# Altium schematic sheet Analog Input Noise Canceller.SchDoc
size A
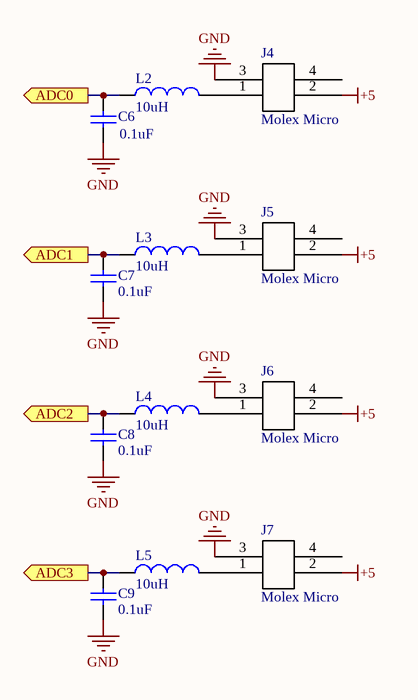
[diagram p0: Analog Input Noise Canceller.SchDoc]

## Parts
C6  0.1uF  [CAPC2013X94X50LL20T25]
C7  0.1uF  [CAPC2013X94X50LL20T25]
C8  0.1uF  [CAPC2013X94X50LL20T25]
C9  0.1uF  [CAPC2013X94X50LL20T25]
J4  Molex Micro  [0430450427]
J5  Molex Micro  [0430450427]
J6  Molex Micro  [0430450427]
J7  Molex Micro  [0430450427]
L2  10uH  [TDK-IND0805-125_V]
L3  10uH  [TDK-IND0805-125_V]
L4  10uH  [TDK-IND0805-125_V]
L5  10uH  [TDK-IND0805-125_V]

## Ports
ADC0 (out), ADC1 (out), ADC2 (out), ADC3 (out)

## Nets
+5: J4.2 J5.2 J6.2 J7.2
GND: C6.2 C7.2 C8.1 C9.1 J4.3 J5.3 J6.3 J7.3
ADC0: C6.1 L2.1 ; port ADC0
ADC1: C7.1 L3.1 ; port ADC1
ADC2: C8.2 L4.1 ; port ADC2
ADC3: C9.2 L5.1 ; port ADC3
NetJ4_1: J4.1 L2.2
NetJ5_1: J5.1 L3.2
NetJ6_1: J6.1 L4.2
NetJ7_1: J7.1 L5.2

Not connected (* = marked no-connect by the designer): J4 4; J5 4; J6 4; J7 4

## Library data of the parts
C6-C9 = CMP-2000-05808-1: Chip Capacitor, 0.1 uF, +/- 5%, 50 V, -55 to 125 degC, 0805 (2012 Metric), RoHS, Tape and Reel; Case Width: 1.25mm; Case Length: 2.01mm; Case Height: 0.94mm; Brand: AVX; Type: StandardX7RMLCCs; Capacitance - nF: 100nF; Dissipation Factor DF: 2.5; Voltage Rating DC: 50V; Temperature Coefficient / Code: +/-15%; Capacitance - pF: 100000pF; Dielectric: X7R; Dimensions: 1.25mmWx2.01mmLx0.94mmH; Product: GeneralTypeMLCCs; Package Description: 2-Pin Surface Mount Device, Body 2.01 x 1.25 mm; Capacitance: 0.1uF; Package / Case: 0805(2012metric); Product Category: MultilayerCeramicCapacitorsMLCC-SMD/SMT; Case Code - mm: 2012; Packaging: Reel; Manufacturer URL: http://www.avx.com/; Operating Temperature Range: -55Cto+125C; Termination Style: SMD/SMT; Maximum Operating Temperature: +125C; Case Code - in: 0805; Minimum Operating Temperature: -55C; Factory Pack Quantity: 4000; RoHS: Details; Voltage Rating: 50V; Tolerance: 5%; Package Reference: 0805; Datasheet URL: http://www.farnell.com/datasheets/1679506.pdf; Manufacturer: AVX; Mounting Technology: SurfaceMount; Datasheet Version: 11/2012
J4-J7 = Molex micro-fit 4-pin (dual row schematic): Molex micro-fit 3.0, P/N 0430450427
L2-L5 = CMP-0266-00001-1: Multilayer Inductor, 10 uH, ±20%, 300 mOhm, 50MHz, 0805(2012); PartNumber: MLZ2012N100LT; DC Resistance: 0.3 Ohm; PackageReference: IND0805-125; ComponentLink1URL: http://www.global.tdk.com/; DatasheetVersion: 05/2013; ComponentLink2Description: Datasheet; ComponentLink1Description: Manufacturer URL; Mounting Technology: Suface Mount; ComponentLink2URL: http://www.tdk.co.jp/tcfx01/c533_mlz.pdf; PackageDescription: 2-Pin SMT Inductor, 2 x 1.25 mm Body